# Altium schematic sheet Arduino.SchDoc
size A; SheetNumber: 1; SheetTotal: 1
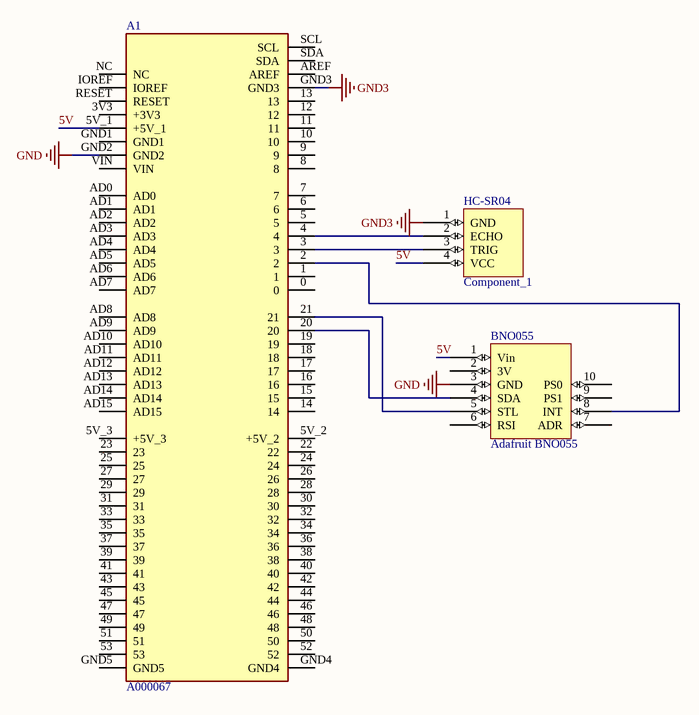
[diagram p0: Arduino.SchDoc]

## Parts
A1  A000067  [ARDUINO_A000067]
BNO055  Adafruit BNO055  [PCBComponent_1]
HC-SR04  Component_1  [PCBComponent_1]

## Nets
GND: A1.GND2 BNO055.3(GND)
GND3: A1.GND3 HC-SR04.1(GND)
5V: A1.5V_1(+5V_1) BNO055.1(Vin) HC-SR04.4(VCC)
NetA1_2: A1.2 BNO055.8(INT)
NetA1_3: A1.3 HC-SR04.3(TRIG)
NetA1_4: A1.4 HC-SR04.2(ECHO)
NetA1_20: A1.20 BNO055.4(SDA)
NetA1_21: A1.21 BNO055.5(STL)

Not connected (* = marked no-connect by the designer): A1 0 1 3V3(+3V3) 5 5V_2(+5V_2) 5V_3(+5V_3) 6 7 8 9 10 11 12 13 14 15 16 17 18 19 22 23 24 25 26 27 28 29 30 31 32 33 34 35 36 37 38 39 40 41 42 43 44 45 46 47 48 49 50 51 52 53 AD0 AD1 AD2 AD3 AD4 AD5 AD6 AD7 AD8 AD9 AD10 AD11 AD12 AD13 AD14 AD15 AREF GND1 GND4 GND5 IOREF NC RESET SCL SDA VIN; BNO055 2(3V) 6(RSI) 7(ADR) 9(PS1) 10(PS0)

## Library data of the parts
A1 = A000067: 8-bit board with 54 digital pins, 16 analog inputs, and 4 serial ports.; MF: Arduino; MP: Arduino Mega 2560 Rev3; SnapEDA_Link: https://www.snapeda.com/parts/Arduino%20Mega%202560%20Rev3/Arduino/view-part/?ref=snap; Package: Non-Standard Arduino; Value: *; Check_prices: https://www.snapeda.com/parts/Arduino%20Mega%202560%20Rev3/Arduino/view-part/?ref=eda
BNO055 = Component_1